# EAGLE design ece521oscillator (EAGLE 9.3.0)
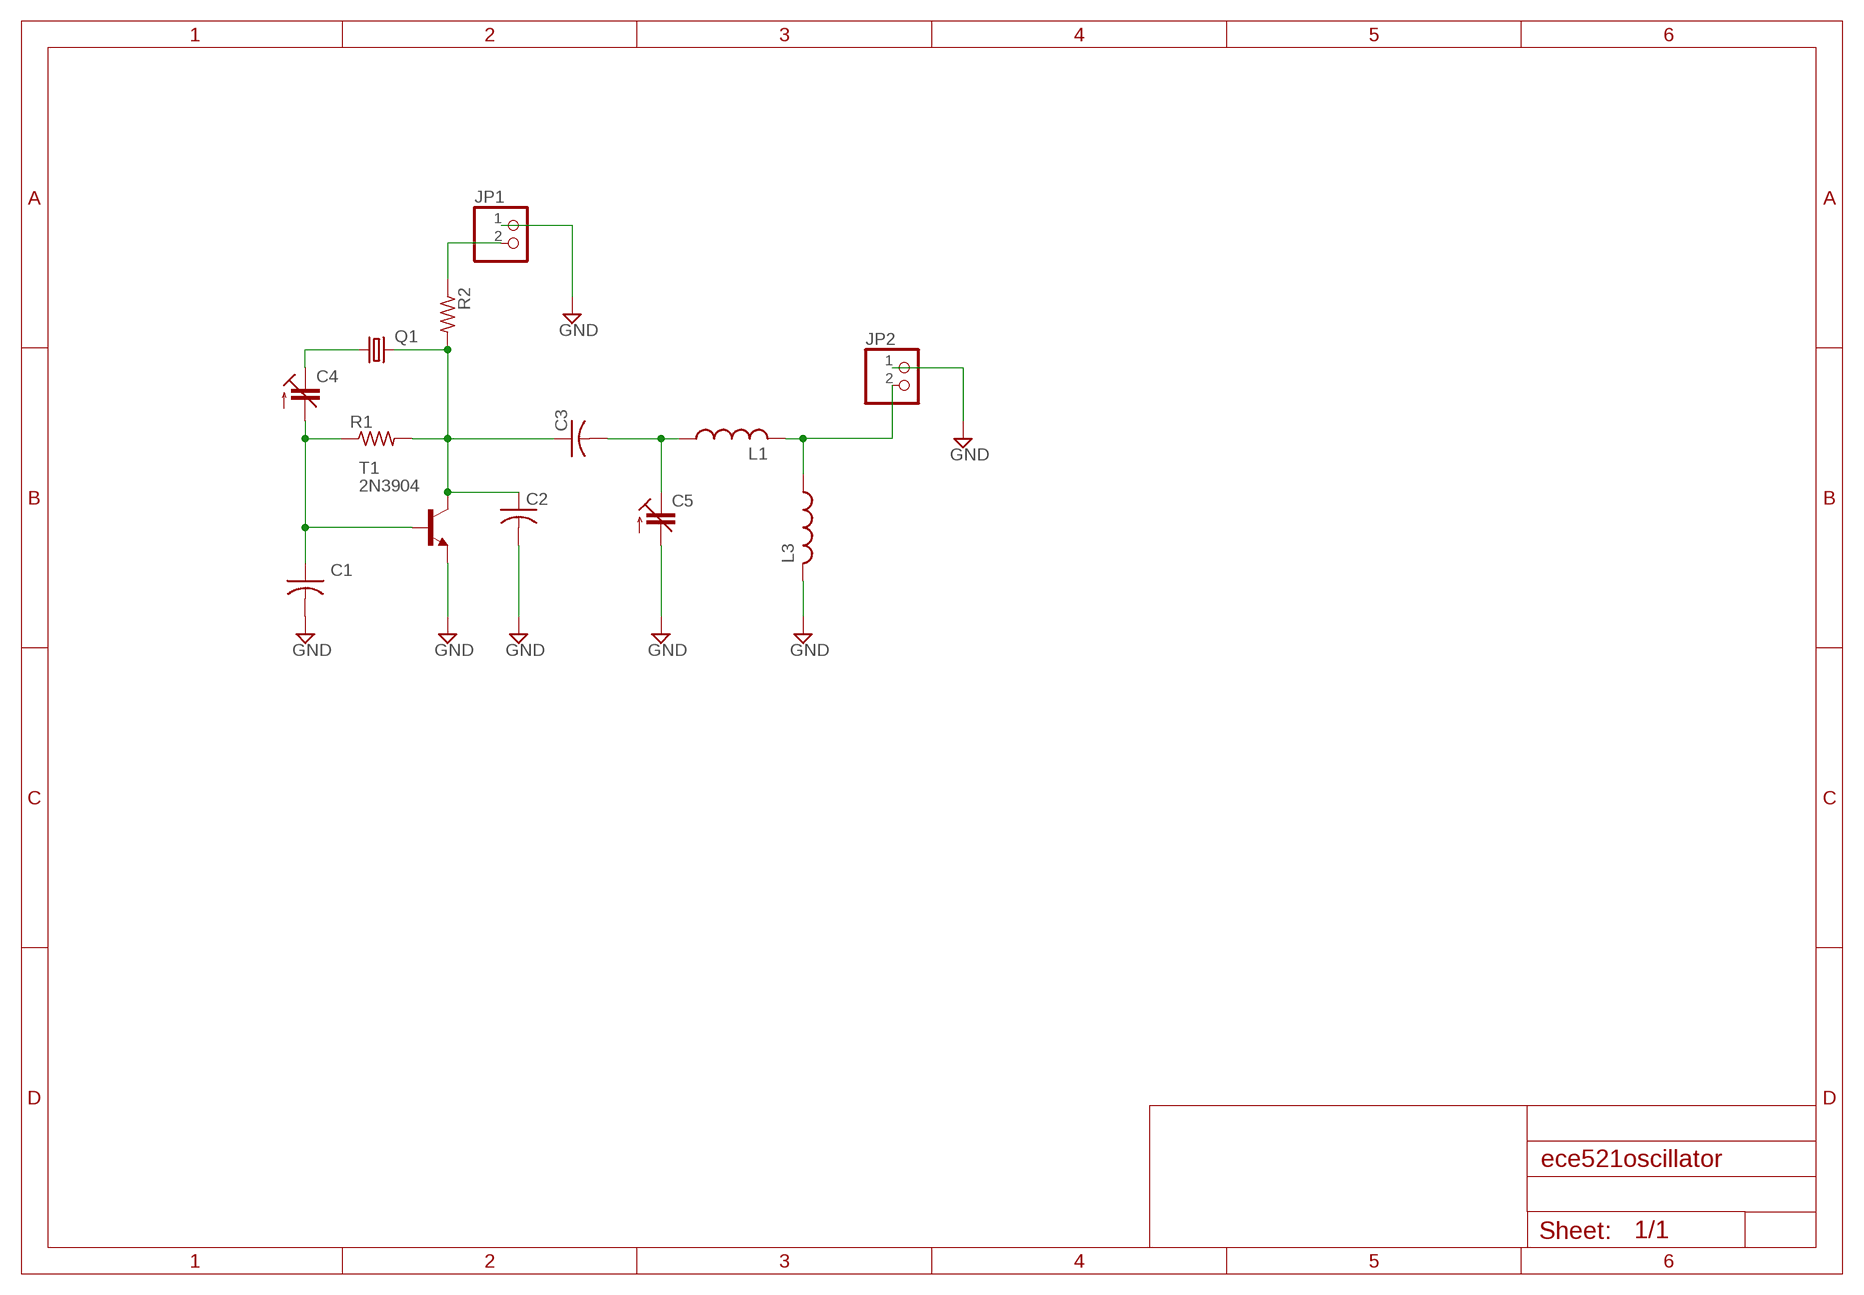
[diagram p0: schematic, sheet 1]

## Parts
C1  C-US050-025X075  [C050-025X075]
C2  C-US050-025X075  [C050-025X075]
C3  C-US050-025X075  [C050-025X075]
C4  C-TRIMM808  [CTRIM808-BC]
C5  C-TRIMM808  [CTRIM808-BC]
JP1  PINHD-1X2  [1X02]
JP2  PINHD-1X2  [1X02]
L1  L-US0204/7  [0204/7]
L3  L-US0204/7  [0204/7]
Q1  CRYSTALHC18U-V  [HC18U-V]
R1  R-US_0204/7  [0204/7]
R2  R-US_0204/7  [0204/7]
T1  2N3904  [TO92]

## Nets
GND: C1.2 C2.2 C5.2(A) JP1.1 JP2.1 L3.2 T1.3(E)
N$1: C4.1(E) Q1.1
N$2: C1.1 C4.2(A) R1.1 T1.2(B)
N$3: C2.1 C3.1 Q1.2 R1.2 R2.2 T1.1(C)
N$4: C3.2 C5.1(E) L1.1
N$5: JP2.2 L1.2 L3.1
N$6: JP1.2 R2.1

## Library data of the parts
C1-C3 = rcl:C-US: CAPACITOR, American symbol; SPICEPREFIX: C
C4 C5 = rcl:C-TRIMM: Trimm capacitor; SPICEPREFIX: C
JP1 JP2 = pinhead:PINHD-1X2: PIN HEADER
L1 L3 = rcl:L-US: INDUCTOR, American symbol; SPICEPREFIX: L
Q1 = crystal:CRYSTAL: CRYSTAL; OC_FARNELL: unknown; OC_NEWARK: unknown
R1 R2 = rcl:R-US_: RESISTOR, American symbol; SPICEPREFIX: R
T1 = transistor-neu-to92:2N3904: NPN TRANSISTOR

## Board
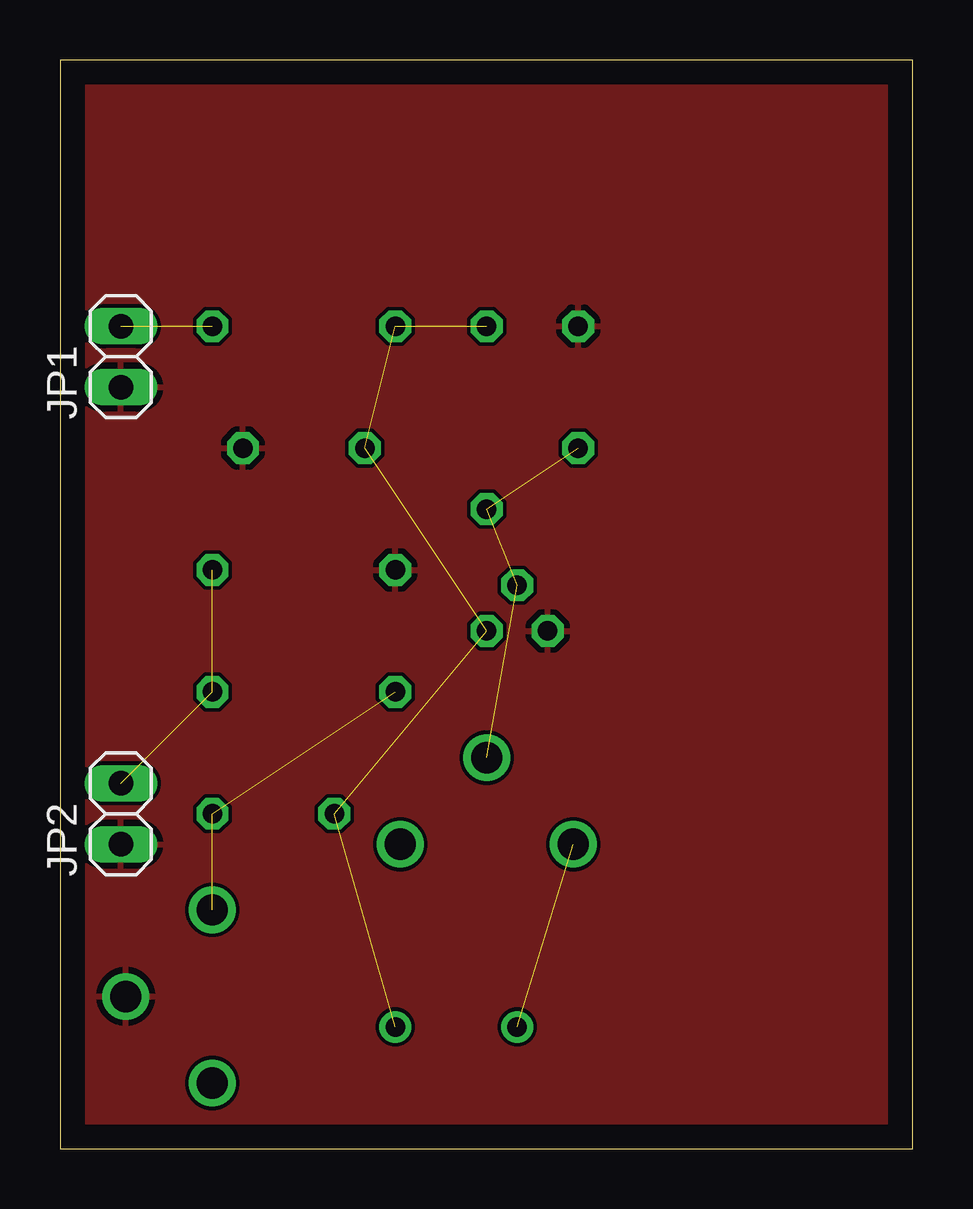
[diagram p1: board, top side]
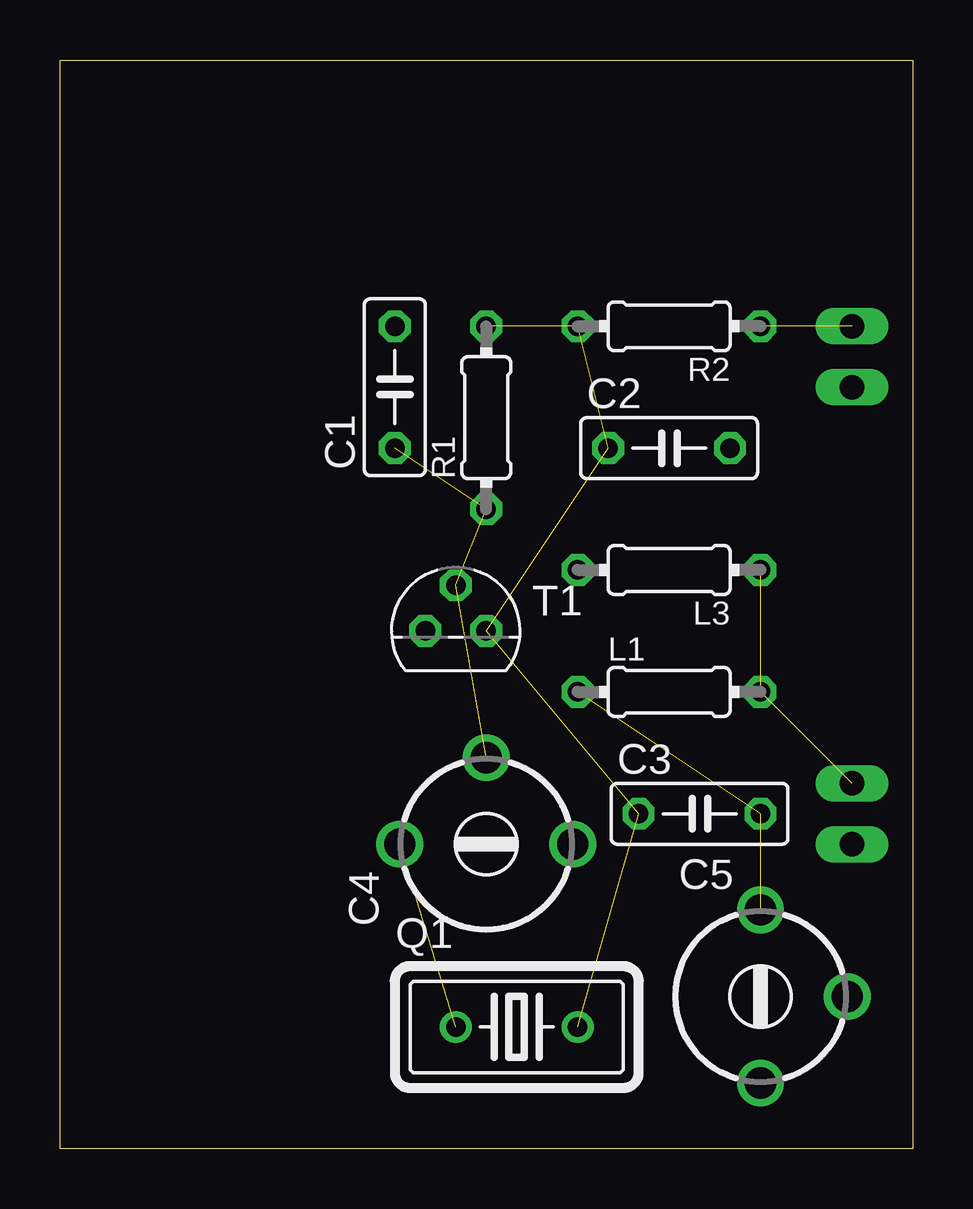
[diagram p2: board, bottom side, seen from below]

Size 35.54 x 45.39 mm. Coordinates in mm from the lower left corner, seen from the top.
Outline: 0,0 35.54,0 35.54,45.39 0,45.39 0,0
Copper layers (1*16): Top 0.035mm / dielectric 1.5mm / Bottom 0.035mm
Design rules "default": minimum track width 6mil, minimum drill 0.35mm, track to track 6mil, track to pad 6mil, pad to pad 6mil, via to via 6mil, smd to smd 6mil, copper to edge 40mil, drill to drill 6mil, minimum pad ring 10mil, minimum via ring 8mil, stop-mask expansion 4mil, vias tented up to drill 0mil, thermal gap 10mil

### Footprints (pad centres in the part's own frame; a part is rotated, then mirrored left to right if it is on the bottom)
C050-025X075 = drill 0.813 octagon: 1 -2.54,0; 2 2.54,0
CTRIM808-BC = drill 1.3: 1 -3.607,0; 2 0,3.607; 3 3.607,0
1X02 = drill 1.016 long: 1 -1.27,0; 2 1.27,0
0204/7 = drill 0.813 octagon: 1 -3.81,0; 2 3.81,0
HC18U-V = drill 0.813: 1 -2.54,0; 2 2.54,0
TO92 = drill 0.813 octagon: 1 1.27,0; 2 0,1.905; 3 -1.27,0

### Placement (x,y rotation side)
C1  21.59,31.75 90 bottom
C2  10.16,29.21 0 bottom
C3  8.89,13.97 0 bottom
C4  17.78,12.7 0 bottom
C5  6.35,6.35 270 bottom
JP1  2.54,33.02 90 top
JP2  2.54,13.97 90 top
L1  10.16,19.05 0 bottom
L3  10.16,24.13 180 bottom
Q1  16.51,5.08 0 bottom
R1  17.78,30.48 90 bottom
R2  10.16,34.29 180 bottom
T1  19.05,21.59 0 bottom

### Tracks (layer width: path | path; a pad name or v marks a point on that pad's centre or on a via)
GND
  pour Top: -7.62,-1.27 166.37,-1.27 166.37,105.41 -7.62,105.41
N$1  (1 unrouted)
N$2  (3 unrouted)
N$3  (5 unrouted)
N$4  (2 unrouted)
N$5  (2 unrouted)
N$6  (1 unrouted)